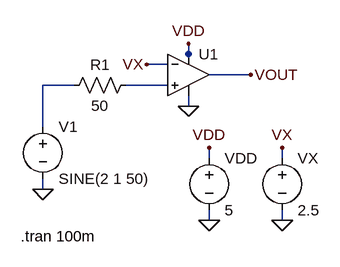
[diagram p0: schematic __Comparator.asc]
__Comparator.asc, the LTspice schematic file:
Version 4
SHEET 1 880 680
WIRE 288 16 288 0
WIRE 256 32 224 32
WIRE 288 32 288 16
WIRE 384 48 320 48
WIRE 112 64 64 64
WIRE 256 64 192 64
WIRE 288 96 288 80
WIRE 64 128 64 64
WIRE 320 176 320 160
WIRE 432 176 432 160
WIRE 64 224 64 208
WIRE 320 272 320 256
WIRE 432 272 432 256
FLAG 64 224 0
FLAG 288 96 0
FLAG 384 48 VOUT
FLAG 288 0 VDD
FLAG 224 32 VX
FLAG 320 160 VDD
FLAG 320 272 0
FLAG 432 272 0
FLAG 432 160 VX
SYMBOL voltage 64 112 R0
WINDOW 123 0 0 Left 0
WINDOW 39 0 0 Left 0
SYMATTR InstName V1
SYMATTR Value SINE(2 1 50)
SYMBOL res 208 48 R90
WINDOW 0 0 56 VBottom 2
WINDOW 3 32 56 VTop 2
SYMATTR InstName R1
SYMATTR Value 50
SYMBOL OpAmps\\UniversalOpamp2 288 48 R0
SYMATTR InstName U1
SYMBOL voltage 320 160 R0
WINDOW 123 0 0 Left 0
WINDOW 39 0 0 Left 0
SYMATTR InstName VDD
SYMATTR Value 5
SYMBOL voltage 432 160 R0
WINDOW 123 0 0 Left 0
WINDOW 39 0 0 Left 0
SYMATTR InstName VX
SYMATTR Value 2.5
TEXT 30 296 Left 2 !.tran 100m

The netlist it stands for:
* __Comparator.asc
V1 N001 0 SINE(2 1 50)
R1 N002 N001 50
XU1 N002 VX VDD 0 VOUT level.2 Avol=1Meg GBW=10Meg Slew=10Meg ilimit=25m rail=0 Vos=0 phimargin=45 en=0 enk=0 in=0 ink=0 Rin=500Meg  ; pins IN+ IN- V+ V- OUT
VDD VDD 0 5
VX VX 0 2.5
.tran 100m
.lib UniversalOpamps2.sub
.backanno
.end